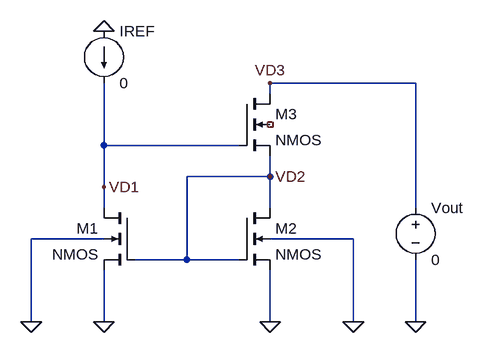
[diagram p0: schematic Chapter03D_06.fig.asc]
Chapter03D_06.fig.asc, the LTspice schematic file:
Version 4
SHEET 1 2940 740
WIRE 256 -144 32 -144
WIRE 32 -128 32 -144
WIRE -224 -48 -224 -144
WIRE -16 -48 -224 -48
WIRE 32 0 32 -32
WIRE 32 0 -96 0
WIRE -224 16 -224 -48
WIRE -224 48 -224 16
WIRE 32 48 32 0
WIRE 256 48 256 -144
WIRE -224 96 -336 96
WIRE 160 96 32 96
WIRE -96 128 -96 0
WIRE -96 128 -176 128
WIRE -16 128 -96 128
WIRE -336 224 -336 96
WIRE -224 224 -224 144
WIRE 32 224 32 144
WIRE 160 224 160 96
WIRE 256 224 256 128
FLAG -224 224 0
FLAG -336 224 0
FLAG 32 224 0
FLAG 160 224 0
FLAG 256 224 0
FLAG -224 -224 0
FLAG 32 0 VD2
FLAG -224 16 VD1
FLAG 32 -144 VD3
SYMBOL nmos4 -176 48 M0
SYMATTR InstName M1
SYMBOL nmos4 -16 48 R0
SYMATTR InstName M2
SYMBOL voltage 256 32 R0
SYMATTR InstName Vout
SYMATTR Value 0
SYMBOL current -224 -224 R0
SYMATTR InstName IREF
SYMATTR Value 0
SYMBOL nmos4 -16 -128 R0
SYMATTR InstName M3

The netlist it stands for:
* Chapter03D_06.fig.asc
M1 VD1 VD2 0 0 NMOS
M2 VD2 VD2 0 0 NMOS
Vout VD3 0 0
IREF 0 VD1 0
M3 VD3 VD1 VD2 NC_01 NMOS
.model NMOS NMOS
.model PMOS PMOS
.lib standard.mos
.backanno
.end